# Altium schematic sheet LokoUSB.SchDoc
size Tabloid
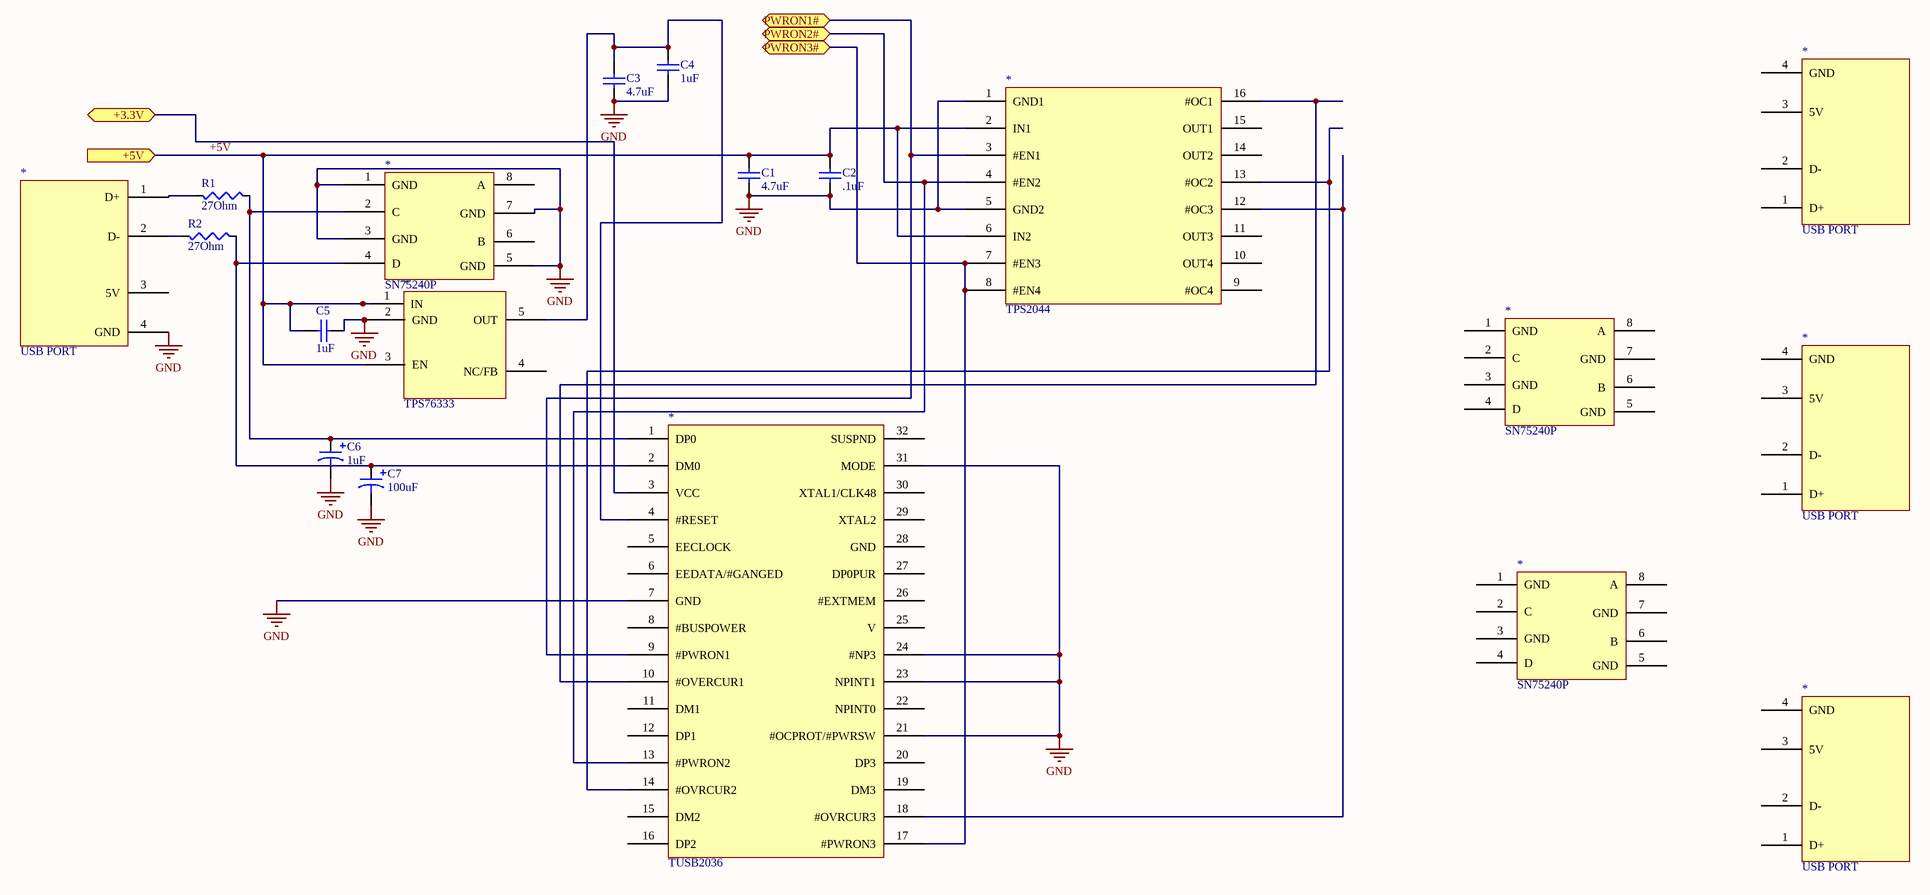
[diagram p0: LokoUSB.SchDoc]

## Parts
(Parts that share a designator on the sheet are numbered #1, #2 ... from top to bottom, then left to right.)
*#1  USB PORT
*#2  TPS2044
*#3  SN75240P
*#4  USB PORT
*#5  TPS76333
*#6  SN75240P
*#7  USB PORT
*#8  SN75240P
*#9  TUSB2036  [TUSB2036]
*#10  USB PORT
C1  4.7uF  [0805 (2012) Capacitor]
C2  .1uF  [0805 (2012) Capacitor]
C3  4.7uF  [0805 (2012) Capacitor]
C4  1uF  [0805 (2012) Capacitor]
C5  1uF  [0805 (2012) Capacitor]
C6  1uF  [Radial (8mm x 15mm, 3.5mm spacing)]
C7  100uF  [Radial (8mm x 15mm, 3.5mm spacing)]
R1  27Ohm  [R 1210 (3225) RESISTOR]
R2  27Ohm  [R 1210 (3225) RESISTOR]

## Ports
+3.3V, +5V (in), PWRON1#, PWRON2#, PWRON3#

## Nets
GND: *#2.1(GND1) *#2.5(GND2) *#3.1(GND) *#3.3(GND) *#3.5(GND) *#3.7(GND) *#4.4(GND) *#5.2(GND) *#9.7(GND) *#9.21(#OCPROT/#PWRSW) *#9.23(NPINT1) *#9.24(#NP3) *#9.31(MODE) C1.1 C2.1 C3.1 C4.1 C5.2 C6.N C7.N
+3.3V: *#9.3(VCC) ; port +3.3V
+5V: *#2.2(IN1) *#2.6(IN2) *#5.1(IN) *#5.3(EN) C1.2 C2.2 C5.1 ; port +5V
PWRON1#: *#2.3(#EN1) *#9.9(#PWRON1) ; port PWRON1#
PWRON2#: *#2.4(#EN2) *#9.13(#PWRON2) ; port PWRON2#
PWRON3#: *#2.7(#EN3) *#2.8(#EN4) *#9.17(#PWRON3) ; port PWRON3#
Net*#2_12: *#2.12(#OC3) *#9.18(#OVRCUR3)
Net*#2_13: *#2.13(#OC2) *#9.14(#OVRCUR2)
Net*#2_16: *#2.16(#OC1) *#9.10(#OVERCUR1)
Net*#3_2: *#3.2(C) *#9.1(DP0) C6.P R1.2
Net*#3_4: *#3.4(D) *#9.2(DM0) C7.P R2.2
Net*#4_1: *#4.1(D+) R1.1
Net*#4_2: *#4.2(D-) R2.1
Net*#5_5: *#5.5(OUT) *#9.4(#RESET) C3.2 C4.2

Not connected (* = marked no-connect by the designer): *#1 1(D+) 2(D-) 3(5V) 4(GND); *#2 9(#OC4) 10(OUT4) 11(OUT3) 14(OUT2) 15(OUT1); *#3 6(B) 8(A); *#4 3(5V); *#5 4(NC/FB); *#6 1(GND) 2(C) 3(GND) 4(D) 5(GND) 6(B) 7(GND) 8(A); *#7 1(D+) 2(D-) 3(5V) 4(GND); *#8 1(GND) 2(C) 3(GND) 4(D) 5(GND) 6(B) 7(GND) 8(A); *#9 5(EECLOCK) 6(EEDATA/#GANGED) 8(#BUSPOWER) 11(DM1) 12(DP1) 15(DM2) 16(DP2) 19(DM3) 20(DP3) 22(NPINT0) 25(V) 26(#EXTMEM) 27(DP0PUR) 28(GND) 29(XTAL2) 30(XTAL1/CLK48) 32(SUSPND); *#10 1(D+) 2(D-) 3(5V) 4(GND)

## Library data of the parts
C1 C3-C5 = Capacitor (non-polarized): Capacitor; Value: .1uF
C2 = Capacitor (non-polarized): Capacitor; Value: .1uF
C6 C7 = Capacitor (polarized)
R1 R2 = Resistor: Value: 0Ohm